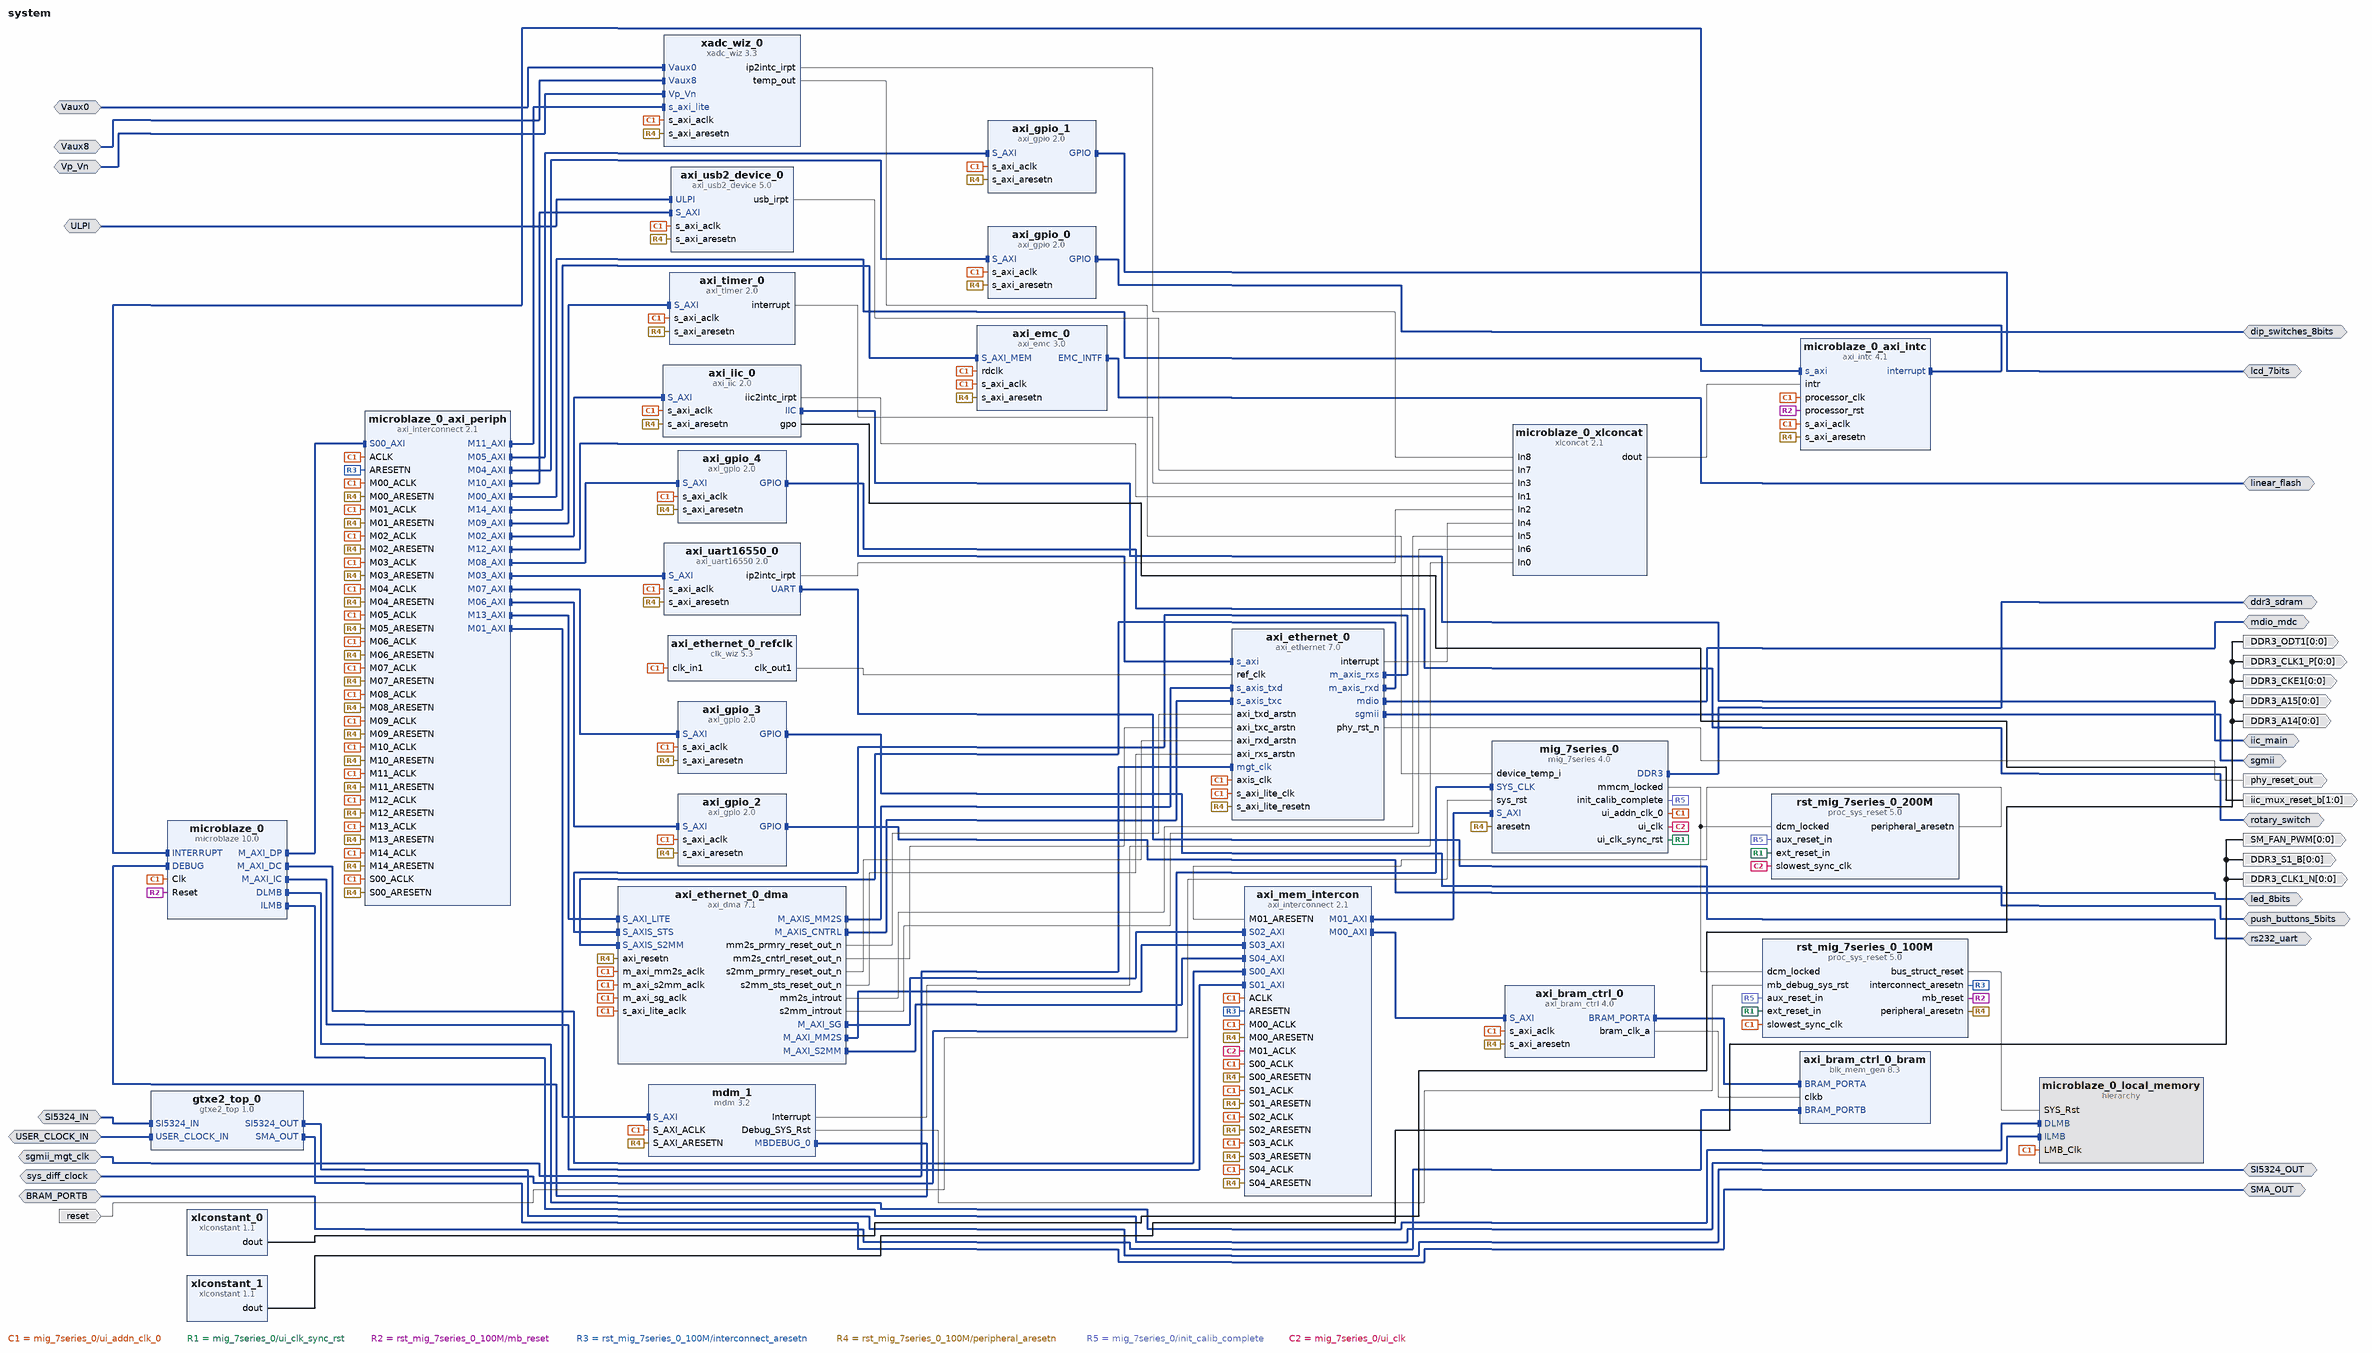
[diagram p0: block diagram of the top level]
# Vivado block design system, xc7vx485tffg1761-2, Vivado 2016.4
create_bd_design system

create_bd_intf_port -mode Slave -vlnv xilinx.com:interface:diff_clock_rtl:1.0 SI5324_IN
create_bd_intf_port -mode Master -vlnv xilinx.com:interface:diff_clock_rtl:1.0 SI5324_OUT
create_bd_intf_port -mode Master -vlnv xilinx.com:interface:diff_clock_rtl:1.0 SMA_OUT
create_bd_intf_port -mode Slave -vlnv xilinx.com:interface:ulpi_rtl:1.0 ULPI
create_bd_intf_port -mode Slave -vlnv xilinx.com:interface:diff_clock_rtl:1.0 USER_CLOCK_IN
create_bd_intf_port -mode Slave -vlnv xilinx.com:interface:diff_analog_io_rtl:1.0 Vaux0
create_bd_intf_port -mode Slave -vlnv xilinx.com:interface:diff_analog_io_rtl:1.0 Vaux8
create_bd_intf_port -mode Slave -vlnv xilinx.com:interface:diff_analog_io_rtl:1.0 Vp_Vn
create_bd_intf_port -mode Master -vlnv xilinx.com:interface:sgmii_rtl:1.0 sgmii
create_bd_intf_port -mode Master -vlnv xilinx.com:interface:mdio_rtl:1.0 mdio_mdc
create_bd_intf_port -mode Slave -vlnv xilinx.com:interface:diff_clock_rtl:1.0 sgmii_mgt_clk
set_property -dict {CONFIG.FREQ_HZ 125000000} [get_bd_intf_ports sgmii_mgt_clk]
create_bd_intf_port -mode Master -vlnv xilinx.com:interface:ddrx_rtl:1.0 ddr3_sdram
create_bd_intf_port -mode Slave -vlnv xilinx.com:interface:diff_clock_rtl:1.0 sys_diff_clock
set_property -dict {CONFIG.FREQ_HZ 100000000} [get_bd_intf_ports sys_diff_clock]
create_bd_intf_port -mode Master -vlnv xilinx.com:interface:gpio_rtl:1.0 dip_switches_8bits
create_bd_intf_port -mode Master -vlnv xilinx.com:interface:gpio_rtl:1.0 lcd_7bits
create_bd_intf_port -mode Master -vlnv xilinx.com:interface:gpio_rtl:1.0 led_8bits
create_bd_intf_port -mode Master -vlnv xilinx.com:interface:gpio_rtl:1.0 push_buttons_5bits
create_bd_intf_port -mode Master -vlnv xilinx.com:interface:gpio_rtl:1.0 rotary_switch
create_bd_intf_port -mode Master -vlnv xilinx.com:interface:iic_rtl:1.0 iic_main
create_bd_intf_port -mode Master -vlnv xilinx.com:interface:uart_rtl:1.0 rs232_uart
create_bd_intf_port -mode Master -vlnv xilinx.com:interface:emc_rtl:1.0 linear_flash
create_bd_intf_port -mode Slave -vlnv xilinx.com:interface:bram_rtl:1.0 BRAM_PORTB
set_property -dict {CONFIG.MEM_SIZE 1048576 CONFIG.MASTER_TYPE BRAM_CTRL} [get_bd_intf_ports BRAM_PORTB]
create_bd_port -dir O -from 1 -to 0 iic_mux_reset_b
create_bd_port -dir O -from 0 -to 0 DDR3_A14
create_bd_port -dir O -from 0 -to 0 DDR3_A15
create_bd_port -dir O -from 0 -to 0 DDR3_CKE1
create_bd_port -dir O -from 0 -to 0 DDR3_CLK1_P
create_bd_port -dir O -from 0 -to 0 DDR3_ODT1
create_bd_port -dir O -from 0 -to 0 DDR3_CLK1_N
create_bd_port -dir O -from 0 -to 0 DDR3_S1_B
create_bd_port -dir O -from 0 -to 0 SM_FAN_PWM
create_bd_port -dir O -type rst phy_reset_out
create_bd_port -dir I -type rst reset
set_property -dict {CONFIG.POLARITY ACTIVE_HIGH} [get_bd_ports reset]

create_bd_cell -type ip -vlnv xilinx.com:user:gtxe2_top:1.0 gtxe2_top_0
create_bd_cell -type hier microblaze_0_local_memory
create_bd_cell -type ip -vlnv xilinx.com:ip:axi_bram_ctrl:4.0 axi_bram_ctrl_0
set_property -dict {CONFIG.SINGLE_PORT_BRAM 1} [get_bd_cells axi_bram_ctrl_0]
create_bd_cell -type ip -vlnv xilinx.com:ip:blk_mem_gen:8.3 axi_bram_ctrl_0_bram
set_property -dict {CONFIG.Memory_Type True_Dual_Port_RAM} [get_bd_cells axi_bram_ctrl_0_bram]
create_bd_cell -type ip -vlnv xilinx.com:ip:axi_emc:3.0 axi_emc_0
set_property -dict [list \
  CONFIG.C_WR_REC_TIME_MEM_0 100000 \
  CONFIG.C_TLZWE_PS_MEM_0 35000 \
  CONFIG.C_TWPH_PS_MEM_0 12000 \
  CONFIG.C_TWP_PS_MEM_0 70000 \
  CONFIG.C_TWC_PS_MEM_0 13000 \
  CONFIG.C_THZCE_PS_MEM_0 35000 \
  CONFIG.C_TPACC_PS_FLASH_0 25000 \
  CONFIG.C_TAVDV_PS_MEM_0 130000 \
  CONFIG.C_TCEDV_PS_MEM_0 130000 \
  CONFIG.USE_BOARD_FLOW true \
  CONFIG.EMC_BOARD_INTERFACE linear_flash \
] [get_bd_cells axi_emc_0]
create_bd_cell -type ip -vlnv xilinx.com:ip:axi_ethernet:7.0 axi_ethernet_0
set_property -dict [list \
  CONFIG.ETHERNET_BOARD_INTERFACE sgmii \
  CONFIG.PHYRST_BOARD_INTERFACE phy_reset_out \
  CONFIG.DIFFCLK_BOARD_INTERFACE sgmii_mgt_clk \
  CONFIG.MDIO_BOARD_INTERFACE mdio_mdc \
  CONFIG.RXMEM 32k \
  CONFIG.TXMEM 32k \
  CONFIG.Frame_Filter false \
  CONFIG.Statistics_Counters false \
] [get_bd_cells axi_ethernet_0]
create_bd_cell -type ip -vlnv xilinx.com:ip:axi_dma:7.1 axi_ethernet_0_dma
set_property -dict [list \
  CONFIG.c_sg_length_width 16 \
  CONFIG.c_include_mm2s_dre 1 \
  CONFIG.c_sg_use_stsapp_length 1 \
  CONFIG.c_include_s2mm_dre 1 \
] [get_bd_cells axi_ethernet_0_dma]
create_bd_cell -type ip -vlnv xilinx.com:ip:clk_wiz:5.3 axi_ethernet_0_refclk
set_property -dict [list \
  CONFIG.CLKOUT1_REQUESTED_OUT_FREQ 200 \
  CONFIG.PRIM_SOURCE Single_ended_clock_capable_pin \
  CONFIG.USE_LOCKED false \
  CONFIG.USE_RESET false \
] [get_bd_cells axi_ethernet_0_refclk]
create_bd_cell -type ip -vlnv xilinx.com:ip:axi_gpio:2.0 axi_gpio_0
set_property -dict {CONFIG.USE_BOARD_FLOW true CONFIG.GPIO_BOARD_INTERFACE dip_switches_8bits} [get_bd_cells axi_gpio_0]
create_bd_cell -type ip -vlnv xilinx.com:ip:axi_gpio:2.0 axi_gpio_1
set_property -dict {CONFIG.USE_BOARD_FLOW true CONFIG.GPIO_BOARD_INTERFACE lcd_7bits} [get_bd_cells axi_gpio_1]
create_bd_cell -type ip -vlnv xilinx.com:ip:axi_gpio:2.0 axi_gpio_2
set_property -dict {CONFIG.USE_BOARD_FLOW true CONFIG.GPIO_BOARD_INTERFACE led_8bits} [get_bd_cells axi_gpio_2]
create_bd_cell -type ip -vlnv xilinx.com:ip:axi_gpio:2.0 axi_gpio_3
set_property -dict {CONFIG.USE_BOARD_FLOW true CONFIG.GPIO_BOARD_INTERFACE push_buttons_5bits} [get_bd_cells axi_gpio_3]
create_bd_cell -type ip -vlnv xilinx.com:ip:axi_gpio:2.0 axi_gpio_4
set_property -dict {CONFIG.USE_BOARD_FLOW true CONFIG.GPIO_BOARD_INTERFACE rotary_switch} [get_bd_cells axi_gpio_4]
create_bd_cell -type ip -vlnv xilinx.com:ip:axi_iic:2.0 axi_iic_0
set_property -dict [list \
  CONFIG.C_GPO_WIDTH 2 \
  CONFIG.C_DEFAULT_VALUE 0xFF \
  CONFIG.C_SCL_INERTIAL_DELAY 5 \
  CONFIG.C_SDA_INERTIAL_DELAY 5 \
  CONFIG.USE_BOARD_FLOW true \
  CONFIG.IIC_BOARD_INTERFACE iic_main \
] [get_bd_cells axi_iic_0]
create_bd_cell -type ip -vlnv xilinx.com:ip:axi_interconnect:2.1 axi_mem_intercon
set_property -dict {CONFIG.NUM_SI 5 CONFIG.NUM_MI 2} [get_bd_cells axi_mem_intercon]
create_bd_cell -type ip -vlnv xilinx.com:ip:axi_timer:2.0 axi_timer_0
create_bd_cell -type ip -vlnv xilinx.com:ip:axi_uart16550:2.0 axi_uart16550_0
set_property -dict {CONFIG.USE_BOARD_FLOW true CONFIG.UART_BOARD_INTERFACE rs232_uart} [get_bd_cells axi_uart16550_0]
create_bd_cell -type ip -vlnv xilinx.com:ip:axi_usb2_device:5.0 axi_usb2_device_0
create_bd_cell -type ip -vlnv xilinx.com:ip:mdm:3.2 mdm_1
set_property -dict {CONFIG.C_USE_UART 1} [get_bd_cells mdm_1]
create_bd_cell -type ip -vlnv xilinx.com:ip:microblaze:10.0 microblaze_0
set_property -dict [list \
  CONFIG.C_D_AXI 1 \
  CONFIG.C_D_LMB 1 \
  CONFIG.C_I_LMB 1 \
  CONFIG.C_DEBUG_ENABLED 1 \
  CONFIG.C_USE_ICACHE 1 \
  CONFIG.C_CACHE_BYTE_SIZE 8192 \
  CONFIG.C_USE_DCACHE 1 \
  CONFIG.C_DCACHE_BYTE_SIZE 8192 \
] [get_bd_cells microblaze_0]
create_bd_cell -type ip -vlnv xilinx.com:ip:axi_intc:4.1 microblaze_0_axi_intc
set_property -dict {CONFIG.C_HAS_FAST 1} [get_bd_cells microblaze_0_axi_intc]
create_bd_cell -type ip -vlnv xilinx.com:ip:axi_interconnect:2.1 microblaze_0_axi_periph
set_property -dict {CONFIG.NUM_MI 15} [get_bd_cells microblaze_0_axi_periph]
create_bd_cell -type ip -vlnv xilinx.com:ip:xlconcat:2.1 microblaze_0_xlconcat
set_property -dict {CONFIG.NUM_PORTS 9} [get_bd_cells microblaze_0_xlconcat]
create_bd_cell -type ip -vlnv xilinx.com:ip:mig_7series:4.0 mig_7series_0
set_property -dict [list \
  CONFIG.XML_INPUT_FILE mig_b.prj \
  CONFIG.RESET_BOARD_INTERFACE reset \
  CONFIG.BOARD_MIG_PARAM ddr3_sdram \
] [get_bd_cells mig_7series_0]
create_bd_cell -type ip -vlnv xilinx.com:ip:proc_sys_reset:5.0 rst_mig_7series_0_100M
create_bd_cell -type ip -vlnv xilinx.com:ip:proc_sys_reset:5.0 rst_mig_7series_0_200M
create_bd_cell -type ip -vlnv xilinx.com:ip:xadc_wiz:3.3 xadc_wiz_0
set_property -dict [list \
  CONFIG.XADC_STARUP_SELECTION simultaneous_sampling \
  CONFIG.SEQUENCER_MODE Off \
  CONFIG.CHANNEL_ENABLE_TEMPERATURE true \
  CONFIG.CHANNEL_ENABLE_VP_VN true \
  CONFIG.CHANNEL_ENABLE_VAUXP0_VAUXN0 true \
  CONFIG.CHANNEL_ENABLE_VAUXP8_VAUXN8 true \
  CONFIG.ENABLE_TEMP_BUS true \
] [get_bd_cells xadc_wiz_0]
create_bd_cell -type ip -vlnv xilinx.com:ip:xlconstant:1.1 xlconstant_0
set_property -dict {CONFIG.CONST_WIDTH 1 CONFIG.CONST_VAL 0} [get_bd_cells xlconstant_0]
create_bd_cell -type ip -vlnv xilinx.com:ip:xlconstant:1.1 xlconstant_1

# ---- hierarchy /microblaze_0_local_memory ----
current_bd_instance /microblaze_0_local_memory
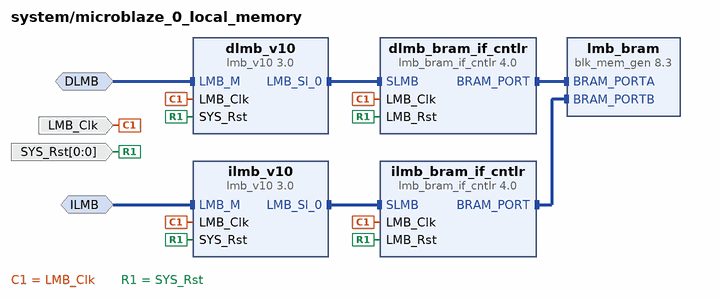
[diagram p1: block diagram inside /microblaze_0_local_memory]
create_bd_intf_pin -mode MirroredMaster -vlnv xilinx.com:interface:lmb_rtl:1.0 DLMB
create_bd_intf_pin -mode MirroredMaster -vlnv xilinx.com:interface:lmb_rtl:1.0 ILMB
create_bd_pin -dir I -type clk LMB_Clk
create_bd_pin -dir I -from 0 -to 0 -type rst SYS_Rst

create_bd_cell -type ip -vlnv xilinx.com:ip:lmb_bram_if_cntlr:4.0 dlmb_bram_if_cntlr
set_property -dict {CONFIG.C_ECC 0} [get_bd_cells dlmb_bram_if_cntlr]
create_bd_cell -type ip -vlnv xilinx.com:ip:lmb_v10:3.0 dlmb_v10
create_bd_cell -type ip -vlnv xilinx.com:ip:lmb_bram_if_cntlr:4.0 ilmb_bram_if_cntlr
set_property -dict {CONFIG.C_ECC 0} [get_bd_cells ilmb_bram_if_cntlr]
create_bd_cell -type ip -vlnv xilinx.com:ip:lmb_v10:3.0 ilmb_v10
create_bd_cell -type ip -vlnv xilinx.com:ip:blk_mem_gen:8.3 lmb_bram
set_property -dict {CONFIG.Memory_Type True_Dual_Port_RAM CONFIG.use_bram_block BRAM_Controller} [get_bd_cells lmb_bram]

# ---- connections ----

current_bd_instance /microblaze_0_local_memory
connect_bd_intf_net -intf_net microblaze_0_dlmb_bus [get_bd_intf_pins dlmb_v10/LMB_Sl_0] [get_bd_intf_pins dlmb_bram_if_cntlr/SLMB]
connect_bd_intf_net -intf_net microblaze_0_ilmb_bus [get_bd_intf_pins ilmb_v10/LMB_Sl_0] [get_bd_intf_pins ilmb_bram_if_cntlr/SLMB]
connect_bd_intf_net -intf_net microblaze_0_dlmb_cntlr [get_bd_intf_pins dlmb_bram_if_cntlr/BRAM_PORT] [get_bd_intf_pins lmb_bram/BRAM_PORTA]
connect_bd_intf_net -intf_net microblaze_0_ilmb_cntlr [get_bd_intf_pins ilmb_bram_if_cntlr/BRAM_PORT] [get_bd_intf_pins lmb_bram/BRAM_PORTB]
connect_bd_intf_net -intf_net microblaze_0_dlmb [get_bd_intf_pins DLMB] [get_bd_intf_pins dlmb_v10/LMB_M]
connect_bd_intf_net -intf_net microblaze_0_ilmb [get_bd_intf_pins ILMB] [get_bd_intf_pins ilmb_v10/LMB_M]
connect_bd_net -net microblaze_0_Clk [get_bd_pins LMB_Clk] \
  [get_bd_pins dlmb_bram_if_cntlr/LMB_Clk] [get_bd_pins dlmb_v10/LMB_Clk] [get_bd_pins ilmb_bram_if_cntlr/LMB_Clk] \
  [get_bd_pins ilmb_v10/LMB_Clk]
connect_bd_net [get_bd_pins SYS_Rst] \
  [get_bd_pins dlmb_bram_if_cntlr/LMB_Rst] [get_bd_pins dlmb_v10/SYS_Rst] [get_bd_pins ilmb_bram_if_cntlr/LMB_Rst] \
  [get_bd_pins ilmb_v10/SYS_Rst]

current_bd_instance /
connect_bd_intf_net [get_bd_intf_pins microblaze_0/DLMB] [get_bd_intf_pins microblaze_0_local_memory/DLMB]
connect_bd_intf_net [get_bd_intf_pins microblaze_0/ILMB] [get_bd_intf_pins microblaze_0_local_memory/ILMB]
connect_bd_intf_net -intf_net microblaze_0_axi_dp [get_bd_intf_pins microblaze_0_axi_periph/S00_AXI] [get_bd_intf_pins microblaze_0/M_AXI_DP]
connect_bd_intf_net [get_bd_intf_pins microblaze_0_axi_intc/interrupt] [get_bd_intf_pins microblaze_0/INTERRUPT]
connect_bd_intf_net -intf_net microblaze_0_intc_axi [get_bd_intf_pins microblaze_0_axi_periph/M00_AXI] [get_bd_intf_pins microblaze_0_axi_intc/s_axi]
connect_bd_intf_net [get_bd_intf_pins mdm_1/MBDEBUG_0] [get_bd_intf_pins microblaze_0/DEBUG]
connect_bd_intf_net -intf_net microblaze_0_mdm_axi [get_bd_intf_pins microblaze_0_axi_periph/M01_AXI] [get_bd_intf_pins mdm_1/S_AXI]
connect_bd_intf_net [get_bd_intf_pins microblaze_0/M_AXI_DC] [get_bd_intf_pins axi_mem_intercon/S00_AXI]
connect_bd_intf_net [get_bd_intf_pins axi_mem_intercon/M00_AXI] [get_bd_intf_pins axi_bram_ctrl_0/S_AXI]
connect_bd_intf_net [get_bd_intf_pins microblaze_0/M_AXI_IC] [get_bd_intf_pins axi_mem_intercon/S01_AXI]
connect_bd_intf_net [get_bd_intf_pins axi_bram_ctrl_0_bram/BRAM_PORTA] [get_bd_intf_pins axi_bram_ctrl_0/BRAM_PORTA]
connect_bd_intf_net [get_bd_intf_pins axi_ethernet_0_dma/M_AXIS_MM2S] [get_bd_intf_pins axi_ethernet_0/s_axis_txd]
connect_bd_intf_net [get_bd_intf_pins axi_ethernet_0_dma/M_AXIS_CNTRL] [get_bd_intf_pins axi_ethernet_0/s_axis_txc]
connect_bd_intf_net [get_bd_intf_pins axi_ethernet_0_dma/S_AXIS_STS] [get_bd_intf_pins axi_ethernet_0/m_axis_rxs]
connect_bd_intf_net [get_bd_intf_pins axi_ethernet_0_dma/S_AXIS_S2MM] [get_bd_intf_pins axi_ethernet_0/m_axis_rxd]
connect_bd_intf_net [get_bd_intf_pins microblaze_0_axi_periph/M02_AXI] [get_bd_intf_pins axi_iic_0/S_AXI]
connect_bd_intf_net [get_bd_intf_pins microblaze_0_axi_periph/M03_AXI] [get_bd_intf_pins axi_uart16550_0/S_AXI]
connect_bd_intf_net [get_bd_intf_pins microblaze_0_axi_periph/M04_AXI] [get_bd_intf_pins axi_gpio_0/S_AXI]
connect_bd_intf_net [get_bd_intf_pins microblaze_0_axi_periph/M05_AXI] [get_bd_intf_pins axi_gpio_1/S_AXI]
connect_bd_intf_net [get_bd_intf_pins microblaze_0_axi_periph/M06_AXI] [get_bd_intf_pins axi_gpio_2/S_AXI]
connect_bd_intf_net [get_bd_intf_pins microblaze_0_axi_periph/M07_AXI] [get_bd_intf_pins axi_gpio_3/S_AXI]
connect_bd_intf_net [get_bd_intf_pins microblaze_0_axi_periph/M08_AXI] [get_bd_intf_pins axi_gpio_4/S_AXI]
connect_bd_intf_net [get_bd_intf_pins microblaze_0_axi_periph/M09_AXI] [get_bd_intf_pins axi_timer_0/S_AXI]
connect_bd_intf_net [get_bd_intf_pins microblaze_0_axi_periph/M10_AXI] [get_bd_intf_pins axi_usb2_device_0/S_AXI]
connect_bd_intf_net [get_bd_intf_pins microblaze_0_axi_periph/M11_AXI] [get_bd_intf_pins xadc_wiz_0/s_axi_lite]
connect_bd_intf_net [get_bd_intf_pins microblaze_0_axi_periph/M12_AXI] [get_bd_intf_pins axi_ethernet_0/s_axi]
connect_bd_intf_net [get_bd_intf_pins microblaze_0_axi_periph/M13_AXI] [get_bd_intf_pins axi_ethernet_0_dma/S_AXI_LITE]
connect_bd_intf_net [get_bd_intf_pins axi_ethernet_0_dma/M_AXI_SG] [get_bd_intf_pins axi_mem_intercon/S02_AXI]
connect_bd_intf_net [get_bd_intf_pins axi_ethernet_0_dma/M_AXI_MM2S] [get_bd_intf_pins axi_mem_intercon/S03_AXI]
connect_bd_intf_net [get_bd_intf_pins axi_ethernet_0_dma/M_AXI_S2MM] [get_bd_intf_pins axi_mem_intercon/S04_AXI]
connect_bd_intf_net [get_bd_intf_pins microblaze_0_axi_periph/M14_AXI] [get_bd_intf_pins axi_emc_0/S_AXI_MEM]
connect_bd_intf_net [get_bd_intf_pins axi_mem_intercon/M01_AXI] [get_bd_intf_pins mig_7series_0/S_AXI]
connect_bd_intf_net [get_bd_intf_ports SI5324_IN] [get_bd_intf_pins gtxe2_top_0/SI5324_IN]
connect_bd_intf_net [get_bd_intf_ports SI5324_OUT] [get_bd_intf_pins gtxe2_top_0/SI5324_OUT]
connect_bd_intf_net [get_bd_intf_ports SMA_OUT] [get_bd_intf_pins gtxe2_top_0/SMA_OUT]
connect_bd_intf_net [get_bd_intf_ports ULPI] [get_bd_intf_pins axi_usb2_device_0/ULPI]
connect_bd_intf_net [get_bd_intf_ports USER_CLOCK_IN] [get_bd_intf_pins gtxe2_top_0/USER_CLOCK_IN]
connect_bd_intf_net -intf_net Vaux0_1 [get_bd_intf_ports Vaux0] [get_bd_intf_pins xadc_wiz_0/Vaux0]
connect_bd_intf_net -intf_net Vaux8_1 [get_bd_intf_ports Vaux8] [get_bd_intf_pins xadc_wiz_0/Vaux8]
connect_bd_intf_net [get_bd_intf_ports Vp_Vn] [get_bd_intf_pins xadc_wiz_0/Vp_Vn]
connect_bd_intf_net [get_bd_intf_ports sgmii] [get_bd_intf_pins axi_ethernet_0/sgmii]
connect_bd_intf_net [get_bd_intf_ports mdio_mdc] [get_bd_intf_pins axi_ethernet_0/mdio]
connect_bd_intf_net [get_bd_intf_ports sgmii_mgt_clk] [get_bd_intf_pins axi_ethernet_0/mgt_clk]
connect_bd_intf_net [get_bd_intf_ports ddr3_sdram] [get_bd_intf_pins mig_7series_0/DDR3]
connect_bd_intf_net [get_bd_intf_ports sys_diff_clock] [get_bd_intf_pins mig_7series_0/SYS_CLK]
connect_bd_intf_net [get_bd_intf_ports dip_switches_8bits] [get_bd_intf_pins axi_gpio_0/GPIO]
connect_bd_intf_net [get_bd_intf_ports lcd_7bits] [get_bd_intf_pins axi_gpio_1/GPIO]
connect_bd_intf_net [get_bd_intf_ports led_8bits] [get_bd_intf_pins axi_gpio_2/GPIO]
connect_bd_intf_net [get_bd_intf_ports push_buttons_5bits] [get_bd_intf_pins axi_gpio_3/GPIO]
connect_bd_intf_net [get_bd_intf_ports rotary_switch] [get_bd_intf_pins axi_gpio_4/GPIO]
connect_bd_intf_net [get_bd_intf_ports iic_main] [get_bd_intf_pins axi_iic_0/IIC]
connect_bd_intf_net [get_bd_intf_ports rs232_uart] [get_bd_intf_pins axi_uart16550_0/UART]
connect_bd_intf_net [get_bd_intf_ports linear_flash] [get_bd_intf_pins axi_emc_0/EMC_INTF]
connect_bd_intf_net [get_bd_intf_ports BRAM_PORTB] [get_bd_intf_pins axi_bram_ctrl_0_bram/BRAM_PORTB]
connect_bd_net [get_bd_pins axi_iic_0/gpo] [get_bd_ports iic_mux_reset_b]
connect_bd_net -net xlconstant_0_const [get_bd_pins xlconstant_0/dout] \
  [get_bd_ports DDR3_ODT1] [get_bd_ports DDR3_CLK1_P] [get_bd_ports DDR3_CKE1] [get_bd_ports DDR3_A15] [get_bd_ports DDR3_A14]
connect_bd_net -net xlconstant_1_const [get_bd_pins xlconstant_1/dout] [get_bd_ports SM_FAN_PWM] [get_bd_ports DDR3_S1_B] [get_bd_ports DDR3_CLK1_N]
connect_bd_net [get_bd_pins axi_ethernet_0/phy_rst_n] [get_bd_ports phy_reset_out]
connect_bd_net -net microblaze_0_intr [get_bd_pins microblaze_0_xlconcat/dout] [get_bd_pins microblaze_0_axi_intc/intr]
connect_bd_net -net microblaze_0_Clk_1 [get_bd_pins mig_7series_0/ui_addn_clk_0] \
  [get_bd_pins axi_bram_ctrl_0/s_axi_aclk] [get_bd_pins axi_emc_0/s_axi_aclk] [get_bd_pins axi_emc_0/rdclk] \
  [get_bd_pins axi_ethernet_0/s_axi_lite_clk] [get_bd_pins axi_ethernet_0/axis_clk] \
  [get_bd_pins axi_ethernet_0_dma/s_axi_lite_aclk] [get_bd_pins axi_ethernet_0_dma/m_axi_sg_aclk] \
  [get_bd_pins axi_ethernet_0_dma/m_axi_mm2s_aclk] [get_bd_pins axi_ethernet_0_dma/m_axi_s2mm_aclk] \
  [get_bd_pins axi_ethernet_0_refclk/clk_in1] [get_bd_pins axi_gpio_0/s_axi_aclk] [get_bd_pins axi_gpio_1/s_axi_aclk] \
  [get_bd_pins axi_gpio_2/s_axi_aclk] [get_bd_pins axi_gpio_3/s_axi_aclk] [get_bd_pins axi_gpio_4/s_axi_aclk] \
  [get_bd_pins axi_iic_0/s_axi_aclk] [get_bd_pins axi_timer_0/s_axi_aclk] [get_bd_pins axi_uart16550_0/s_axi_aclk] \
  [get_bd_pins axi_usb2_device_0/s_axi_aclk] [get_bd_pins mdm_1/S_AXI_ACLK] [get_bd_pins microblaze_0/Clk] \
  [get_bd_pins microblaze_0_axi_intc/s_axi_aclk] [get_bd_pins microblaze_0_axi_intc/processor_clk] \
  [get_bd_pins rst_mig_7series_0_100M/slowest_sync_clk] [get_bd_pins xadc_wiz_0/s_axi_aclk] \
  [get_bd_pins microblaze_0_local_memory/LMB_Clk] [get_bd_pins axi_mem_intercon/ACLK] [get_bd_pins axi_mem_intercon/S00_ACLK] \
  [get_bd_pins axi_mem_intercon/M00_ACLK] [get_bd_pins axi_mem_intercon/S01_ACLK] [get_bd_pins axi_mem_intercon/S02_ACLK] \
  [get_bd_pins axi_mem_intercon/S03_ACLK] [get_bd_pins axi_mem_intercon/S04_ACLK] [get_bd_pins microblaze_0_axi_periph/ACLK] \
  [get_bd_pins microblaze_0_axi_periph/S00_ACLK] [get_bd_pins microblaze_0_axi_periph/M00_ACLK] \
  [get_bd_pins microblaze_0_axi_periph/M01_ACLK] [get_bd_pins microblaze_0_axi_periph/M02_ACLK] \
  [get_bd_pins microblaze_0_axi_periph/M03_ACLK] [get_bd_pins microblaze_0_axi_periph/M04_ACLK] \
  [get_bd_pins microblaze_0_axi_periph/M05_ACLK] [get_bd_pins microblaze_0_axi_periph/M06_ACLK] \
  [get_bd_pins microblaze_0_axi_periph/M07_ACLK] [get_bd_pins microblaze_0_axi_periph/M08_ACLK] \
  [get_bd_pins microblaze_0_axi_periph/M09_ACLK] [get_bd_pins microblaze_0_axi_periph/M10_ACLK] \
  [get_bd_pins microblaze_0_axi_periph/M11_ACLK] [get_bd_pins microblaze_0_axi_periph/M12_ACLK] \
  [get_bd_pins microblaze_0_axi_periph/M13_ACLK] [get_bd_pins microblaze_0_axi_periph/M14_ACLK]
connect_bd_net [get_bd_pins mig_7series_0/mmcm_locked] [get_bd_pins rst_mig_7series_0_100M/dcm_locked] [get_bd_pins rst_mig_7series_0_200M/dcm_locked]
connect_bd_net [get_bd_pins mig_7series_0/ui_clk_sync_rst] \
  [get_bd_pins rst_mig_7series_0_100M/ext_reset_in] [get_bd_pins rst_mig_7series_0_200M/ext_reset_in]
connect_bd_net [get_bd_pins rst_mig_7series_0_100M/mb_reset] [get_bd_pins microblaze_0/Reset] [get_bd_pins microblaze_0_axi_intc/processor_rst]
connect_bd_net [get_bd_pins rst_mig_7series_0_100M/bus_struct_reset] [get_bd_pins microblaze_0_local_memory/SYS_Rst]
connect_bd_net [get_bd_pins rst_mig_7series_0_100M/interconnect_aresetn] \
  [get_bd_pins axi_mem_intercon/ARESETN] [get_bd_pins microblaze_0_axi_periph/ARESETN]
connect_bd_net [get_bd_pins rst_mig_7series_0_100M/peripheral_aresetn] \
  [get_bd_pins axi_bram_ctrl_0/s_axi_aresetn] [get_bd_pins axi_emc_0/s_axi_aresetn] \
  [get_bd_pins axi_ethernet_0/s_axi_lite_resetn] [get_bd_pins axi_ethernet_0_dma/axi_resetn] \
  [get_bd_pins axi_gpio_0/s_axi_aresetn] [get_bd_pins axi_gpio_1/s_axi_aresetn] [get_bd_pins axi_gpio_2/s_axi_aresetn] \
  [get_bd_pins axi_gpio_3/s_axi_aresetn] [get_bd_pins axi_gpio_4/s_axi_aresetn] [get_bd_pins axi_iic_0/s_axi_aresetn] \
  [get_bd_pins axi_timer_0/s_axi_aresetn] [get_bd_pins axi_uart16550_0/s_axi_aresetn] \
  [get_bd_pins axi_usb2_device_0/s_axi_aresetn] [get_bd_pins mdm_1/S_AXI_ARESETN] \
  [get_bd_pins microblaze_0_axi_intc/s_axi_aresetn] [get_bd_pins mig_7series_0/aresetn] \
  [get_bd_pins xadc_wiz_0/s_axi_aresetn] [get_bd_pins axi_mem_intercon/S00_ARESETN] \
  [get_bd_pins axi_mem_intercon/M00_ARESETN] [get_bd_pins axi_mem_intercon/S01_ARESETN] \
  [get_bd_pins axi_mem_intercon/S02_ARESETN] [get_bd_pins axi_mem_intercon/S03_ARESETN] \
  [get_bd_pins axi_mem_intercon/S04_ARESETN] [get_bd_pins microblaze_0_axi_periph/S00_ARESETN] \
  [get_bd_pins microblaze_0_axi_periph/M00_ARESETN] [get_bd_pins microblaze_0_axi_periph/M01_ARESETN] \
  [get_bd_pins microblaze_0_axi_periph/M02_ARESETN] [get_bd_pins microblaze_0_axi_periph/M03_ARESETN] \
  [get_bd_pins microblaze_0_axi_periph/M04_ARESETN] [get_bd_pins microblaze_0_axi_periph/M05_ARESETN] \
  [get_bd_pins microblaze_0_axi_periph/M06_ARESETN] [get_bd_pins microblaze_0_axi_periph/M07_ARESETN] \
  [get_bd_pins microblaze_0_axi_periph/M08_ARESETN] [get_bd_pins microblaze_0_axi_periph/M09_ARESETN] \
  [get_bd_pins microblaze_0_axi_periph/M10_ARESETN] [get_bd_pins microblaze_0_axi_periph/M11_ARESETN] \
  [get_bd_pins microblaze_0_axi_periph/M12_ARESETN] [get_bd_pins microblaze_0_axi_periph/M13_ARESETN] \
  [get_bd_pins microblaze_0_axi_periph/M14_ARESETN]
connect_bd_net [get_bd_pins mdm_1/Debug_SYS_Rst] [get_bd_pins rst_mig_7series_0_100M/mb_debug_sys_rst]
connect_bd_net [get_bd_ports reset] [get_bd_pins mig_7series_0/sys_rst]
connect_bd_net [get_bd_pins axi_ethernet_0_dma/mm2s_prmry_reset_out_n] [get_bd_pins axi_ethernet_0/axi_txd_arstn]
connect_bd_net [get_bd_pins axi_ethernet_0_dma/mm2s_cntrl_reset_out_n] [get_bd_pins axi_ethernet_0/axi_txc_arstn]
connect_bd_net [get_bd_pins axi_ethernet_0_dma/s2mm_prmry_reset_out_n] [get_bd_pins axi_ethernet_0/axi_rxd_arstn]
connect_bd_net [get_bd_pins axi_ethernet_0_dma/s2mm_sts_reset_out_n] [get_bd_pins axi_ethernet_0/axi_rxs_arstn]
connect_bd_net [get_bd_pins axi_ethernet_0_refclk/clk_out1] [get_bd_pins axi_ethernet_0/ref_clk]
connect_bd_net [get_bd_pins mdm_1/Interrupt] [get_bd_pins microblaze_0_xlconcat/In0]
connect_bd_net [get_bd_pins axi_iic_0/iic2intc_irpt] [get_bd_pins microblaze_0_xlconcat/In1]
connect_bd_net [get_bd_pins axi_uart16550_0/ip2intc_irpt] [get_bd_pins microblaze_0_xlconcat/In2]
connect_bd_net [get_bd_pins xadc_wiz_0/temp_out] [get_bd_pins mig_7series_0/device_temp_i]
connect_bd_net [get_bd_pins axi_timer_0/interrupt] [get_bd_pins microblaze_0_xlconcat/In3]
connect_bd_net [get_bd_pins axi_ethernet_0/interrupt] [get_bd_pins microblaze_0_xlconcat/In4]
connect_bd_net [get_bd_pins axi_ethernet_0_dma/mm2s_introut] [get_bd_pins microblaze_0_xlconcat/In5]
connect_bd_net [get_bd_pins axi_ethernet_0_dma/s2mm_introut] [get_bd_pins microblaze_0_xlconcat/In6]
connect_bd_net [get_bd_pins axi_usb2_device_0/usb_irpt] [get_bd_pins microblaze_0_xlconcat/In7]
connect_bd_net [get_bd_pins mig_7series_0/init_calib_complete] \
  [get_bd_pins rst_mig_7series_0_100M/aux_reset_in] [get_bd_pins rst_mig_7series_0_200M/aux_reset_in]
connect_bd_net [get_bd_pins xadc_wiz_0/ip2intc_irpt] [get_bd_pins microblaze_0_xlconcat/In8]
connect_bd_net [get_bd_pins mig_7series_0/ui_clk] [get_bd_pins rst_mig_7series_0_200M/slowest_sync_clk] [get_bd_pins axi_mem_intercon/M01_ACLK]
connect_bd_net [get_bd_pins rst_mig_7series_0_200M/peripheral_aresetn] [get_bd_pins axi_mem_intercon/M01_ARESETN]
connect_bd_net [get_bd_pins axi_bram_ctrl_0/bram_clk_a] [get_bd_pins axi_bram_ctrl_0_bram/clkb]

# ---- address map ----
assign_bd_address -offset 0x80000000 -range 1G -target_address_space [get_bd_addr_spaces axi_ethernet_0_dma/Data_MM2S] [get_bd_addr_segs mig_7series_0/memmap/memaddr]
assign_bd_address -offset 0xC0000000 -range 1M -target_address_space [get_bd_addr_spaces axi_ethernet_0_dma/Data_MM2S] [get_bd_addr_segs axi_bram_ctrl_0/S_AXI/Mem0]
assign_bd_address -offset 0x80000000 -range 1G -target_address_space [get_bd_addr_spaces axi_ethernet_0_dma/Data_S2MM] [get_bd_addr_segs mig_7series_0/memmap/memaddr]
assign_bd_address -offset 0xC0000000 -range 1M -target_address_space [get_bd_addr_spaces axi_ethernet_0_dma/Data_S2MM] [get_bd_addr_segs axi_bram_ctrl_0/S_AXI/Mem0]
assign_bd_address -offset 0x80000000 -range 1G -target_address_space [get_bd_addr_spaces axi_ethernet_0_dma/Data_SG] [get_bd_addr_segs mig_7series_0/memmap/memaddr]
assign_bd_address -offset 0xC0000000 -range 1M -target_address_space [get_bd_addr_spaces axi_ethernet_0_dma/Data_SG] [get_bd_addr_segs axi_bram_ctrl_0/S_AXI/Mem0]
assign_bd_address -offset 0x00000000 -range 128K -target_address_space [get_bd_addr_spaces microblaze_0/Data] [get_bd_addr_segs microblaze_0_local_memory/dlmb_bram_if_cntlr/SLMB/Mem]
assign_bd_address -offset 0x40000000 -range 64K -target_address_space [get_bd_addr_spaces microblaze_0/Data] [get_bd_addr_segs axi_gpio_0/S_AXI/Reg]
assign_bd_address -offset 0x40010000 -range 64K -target_address_space [get_bd_addr_spaces microblaze_0/Data] [get_bd_addr_segs axi_gpio_1/S_AXI/Reg]
assign_bd_address -offset 0x40020000 -range 64K -target_address_space [get_bd_addr_spaces microblaze_0/Data] [get_bd_addr_segs axi_gpio_2/S_AXI/Reg]
assign_bd_address -offset 0x40030000 -range 64K -target_address_space [get_bd_addr_spaces microblaze_0/Data] [get_bd_addr_segs axi_gpio_3/S_AXI/Reg]
assign_bd_address -offset 0x40040000 -range 64K -target_address_space [get_bd_addr_spaces microblaze_0/Data] [get_bd_addr_segs axi_gpio_4/S_AXI/Reg]
assign_bd_address -offset 0x40800000 -range 64K -target_address_space [get_bd_addr_spaces microblaze_0/Data] [get_bd_addr_segs axi_iic_0/S_AXI/Reg]
assign_bd_address -offset 0x40C00000 -range 256K -target_address_space [get_bd_addr_spaces microblaze_0/Data] [get_bd_addr_segs axi_ethernet_0/s_axi/Reg0]
assign_bd_address -offset 0x41200000 -range 64K -target_address_space [get_bd_addr_spaces microblaze_0/Data] [get_bd_addr_segs microblaze_0_axi_intc/S_AXI/Reg]
assign_bd_address -offset 0x41400000 -range 4K -target_address_space [get_bd_addr_spaces microblaze_0/Data] [get_bd_addr_segs mdm_1/S_AXI/Reg]
assign_bd_address -offset 0x41C00000 -range 64K -target_address_space [get_bd_addr_spaces microblaze_0/Data] [get_bd_addr_segs axi_timer_0/S_AXI/Reg]
assign_bd_address -offset 0x41E00000 -range 64K -target_address_space [get_bd_addr_spaces microblaze_0/Data] [get_bd_addr_segs axi_ethernet_0_dma/S_AXI_LITE/Reg]
assign_bd_address -offset 0x44800000 -range 64K -target_address_space [get_bd_addr_spaces microblaze_0/Data] [get_bd_addr_segs axi_usb2_device_0/S_AXI/Reg]
assign_bd_address -offset 0x44A00000 -range 64K -target_address_space [get_bd_addr_spaces microblaze_0/Data] [get_bd_addr_segs axi_uart16550_0/S_AXI/Reg]
assign_bd_address -offset 0x44A10000 -range 64K -target_address_space [get_bd_addr_spaces microblaze_0/Data] [get_bd_addr_segs xadc_wiz_0/s_axi_lite/Reg]
assign_bd_address -offset 0x60000000 -range 128M -target_address_space [get_bd_addr_spaces microblaze_0/Data] [get_bd_addr_segs axi_emc_0/S_AXI_MEM/MEM0]
assign_bd_address -offset 0x80000000 -range 1G -target_address_space [get_bd_addr_spaces microblaze_0/Data] [get_bd_addr_segs mig_7series_0/memmap/memaddr]
assign_bd_address -offset 0xC0000000 -range 1M -target_address_space [get_bd_addr_spaces microblaze_0/Data] [get_bd_addr_segs axi_bram_ctrl_0/S_AXI/Mem0]
assign_bd_address -offset 0x00000000 -range 128K -target_address_space [get_bd_addr_spaces microblaze_0/Instruction] [get_bd_addr_segs microblaze_0_local_memory/ilmb_bram_if_cntlr/SLMB/Mem]
assign_bd_address -offset 0x80000000 -range 1G -target_address_space [get_bd_addr_spaces microblaze_0/Instruction] [get_bd_addr_segs mig_7series_0/memmap/memaddr]
assign_bd_address -offset 0xC0000000 -range 1M -target_address_space [get_bd_addr_spaces microblaze_0/Instruction] [get_bd_addr_segs axi_bram_ctrl_0/S_AXI/Mem0]

validate_bd_design
save_bd_design
